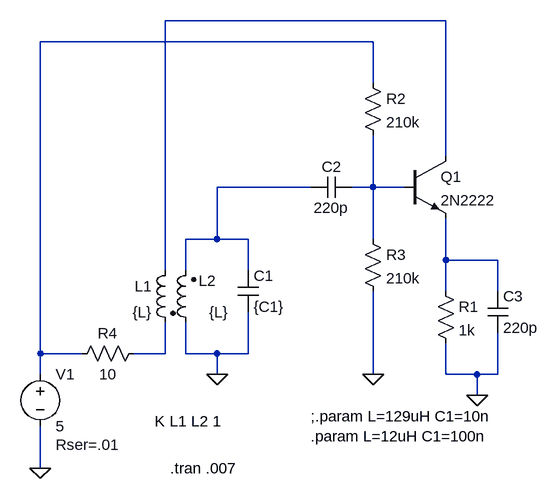
[diagram p0: schematic Armstrong1.asc]
Armstrong1.asc, the LTspice schematic file:
Version 4
SHEET 1 900 680
WIRE 672 -272 240 -272
WIRE 560 -240 48 -240
WIRE 560 -176 560 -240
WIRE 672 -64 672 -272
WIRE 464 -16 320 -16
WIRE 560 -16 560 -96
WIRE 560 -16 528 -16
WIRE 608 -16 560 -16
WIRE 320 64 320 -16
WIRE 320 64 272 64
WIRE 368 64 320 64
WIRE 560 64 560 -16
WIRE 672 96 672 32
WIRE 752 96 672 96
WIRE 240 112 240 -272
WIRE 272 112 272 64
WIRE 368 112 368 64
WIRE 672 144 672 96
WIRE 752 144 752 96
WIRE 48 240 48 -240
WIRE 112 240 48 240
WIRE 240 240 240 192
WIRE 240 240 192 240
WIRE 272 240 272 192
WIRE 320 240 272 240
WIRE 368 240 368 176
WIRE 368 240 320 240
WIRE 48 272 48 240
WIRE 320 272 320 240
WIRE 560 272 560 144
WIRE 672 272 672 224
WIRE 720 272 672 272
WIRE 752 272 752 208
WIRE 752 272 720 272
WIRE 720 304 720 272
WIRE 48 416 48 352
FLAG 48 416 0
FLAG 320 272 0
FLAG 720 304 0
FLAG 560 272 0
SYMBOL ind2 256 96 M0
SYMATTR InstName L1
SYMATTR Value {L}
SYMATTR Type ind
SYMBOL ind2 288 208 R180
WINDOW 0 -31 80 Left 2
WINDOW 3 -50 32 Left 2
SYMATTR InstName L2
SYMATTR Value {L}
SYMATTR Type ind
SYMBOL cap 352 112 R0
SYMATTR InstName C1
SYMATTR Value {C1}
SYMBOL cap 528 -32 R90
WINDOW 0 0 32 VBottom 2
WINDOW 3 32 32 VTop 2
SYMATTR InstName C2
SYMATTR Value 220p
SYMBOL npn 608 -64 R0
SYMATTR InstName Q1
SYMATTR Value 2N2222
SYMBOL cap 736 144 R0
SYMATTR InstName C3
SYMATTR Value 220p
SYMBOL res 656 128 R0
SYMATTR InstName R1
SYMATTR Value 1k
SYMBOL res 544 -192 R0
SYMATTR InstName R2
SYMATTR Value 210k
SYMBOL res 544 48 R0
SYMATTR InstName R3
SYMATTR Value 210k
SYMBOL voltage 48 256 R0
WINDOW 123 0 0 Left 0
WINDOW 39 24 124 Left 2
SYMATTR SpiceLine Rser=.01
SYMATTR InstName V1
SYMATTR Value 5
SYMBOL res 208 224 R90
WINDOW 0 0 56 VBottom 2
WINDOW 3 32 56 VTop 2
SYMATTR InstName R4
SYMATTR Value 10
TEXT 248 416 Left 2 !.tran .007
TEXT 224 344 Left 2 !K L1 L2 1
TEXT 464 336 Left 2 !;.param L=129uH C1=10n\n.param L=12uH C1=100n

The netlist it stands for:
* Armstrong1.asc
L1 N001 N006 {L}
L2 0 N003 {L}
C1 N003 0 {C1}
C2 N004 N003 220p
Q1 N001 N004 N005 0 2N2222
C3 N005 0 220p
R1 N005 0 1k
R2 N002 N004 210k
R3 N004 0 210k
V1 N002 0 5 Rser=.01
R4 N006 N002 10
.model NPN NPN
.model PNP PNP
.lib standard.bjt
.tran .007
K L1 L2 1
;.param L=129uH C1=10n
.param L=12uH C1=100n
.backanno
.end